# Altium project Smart_AC_Meter.PrjPcb
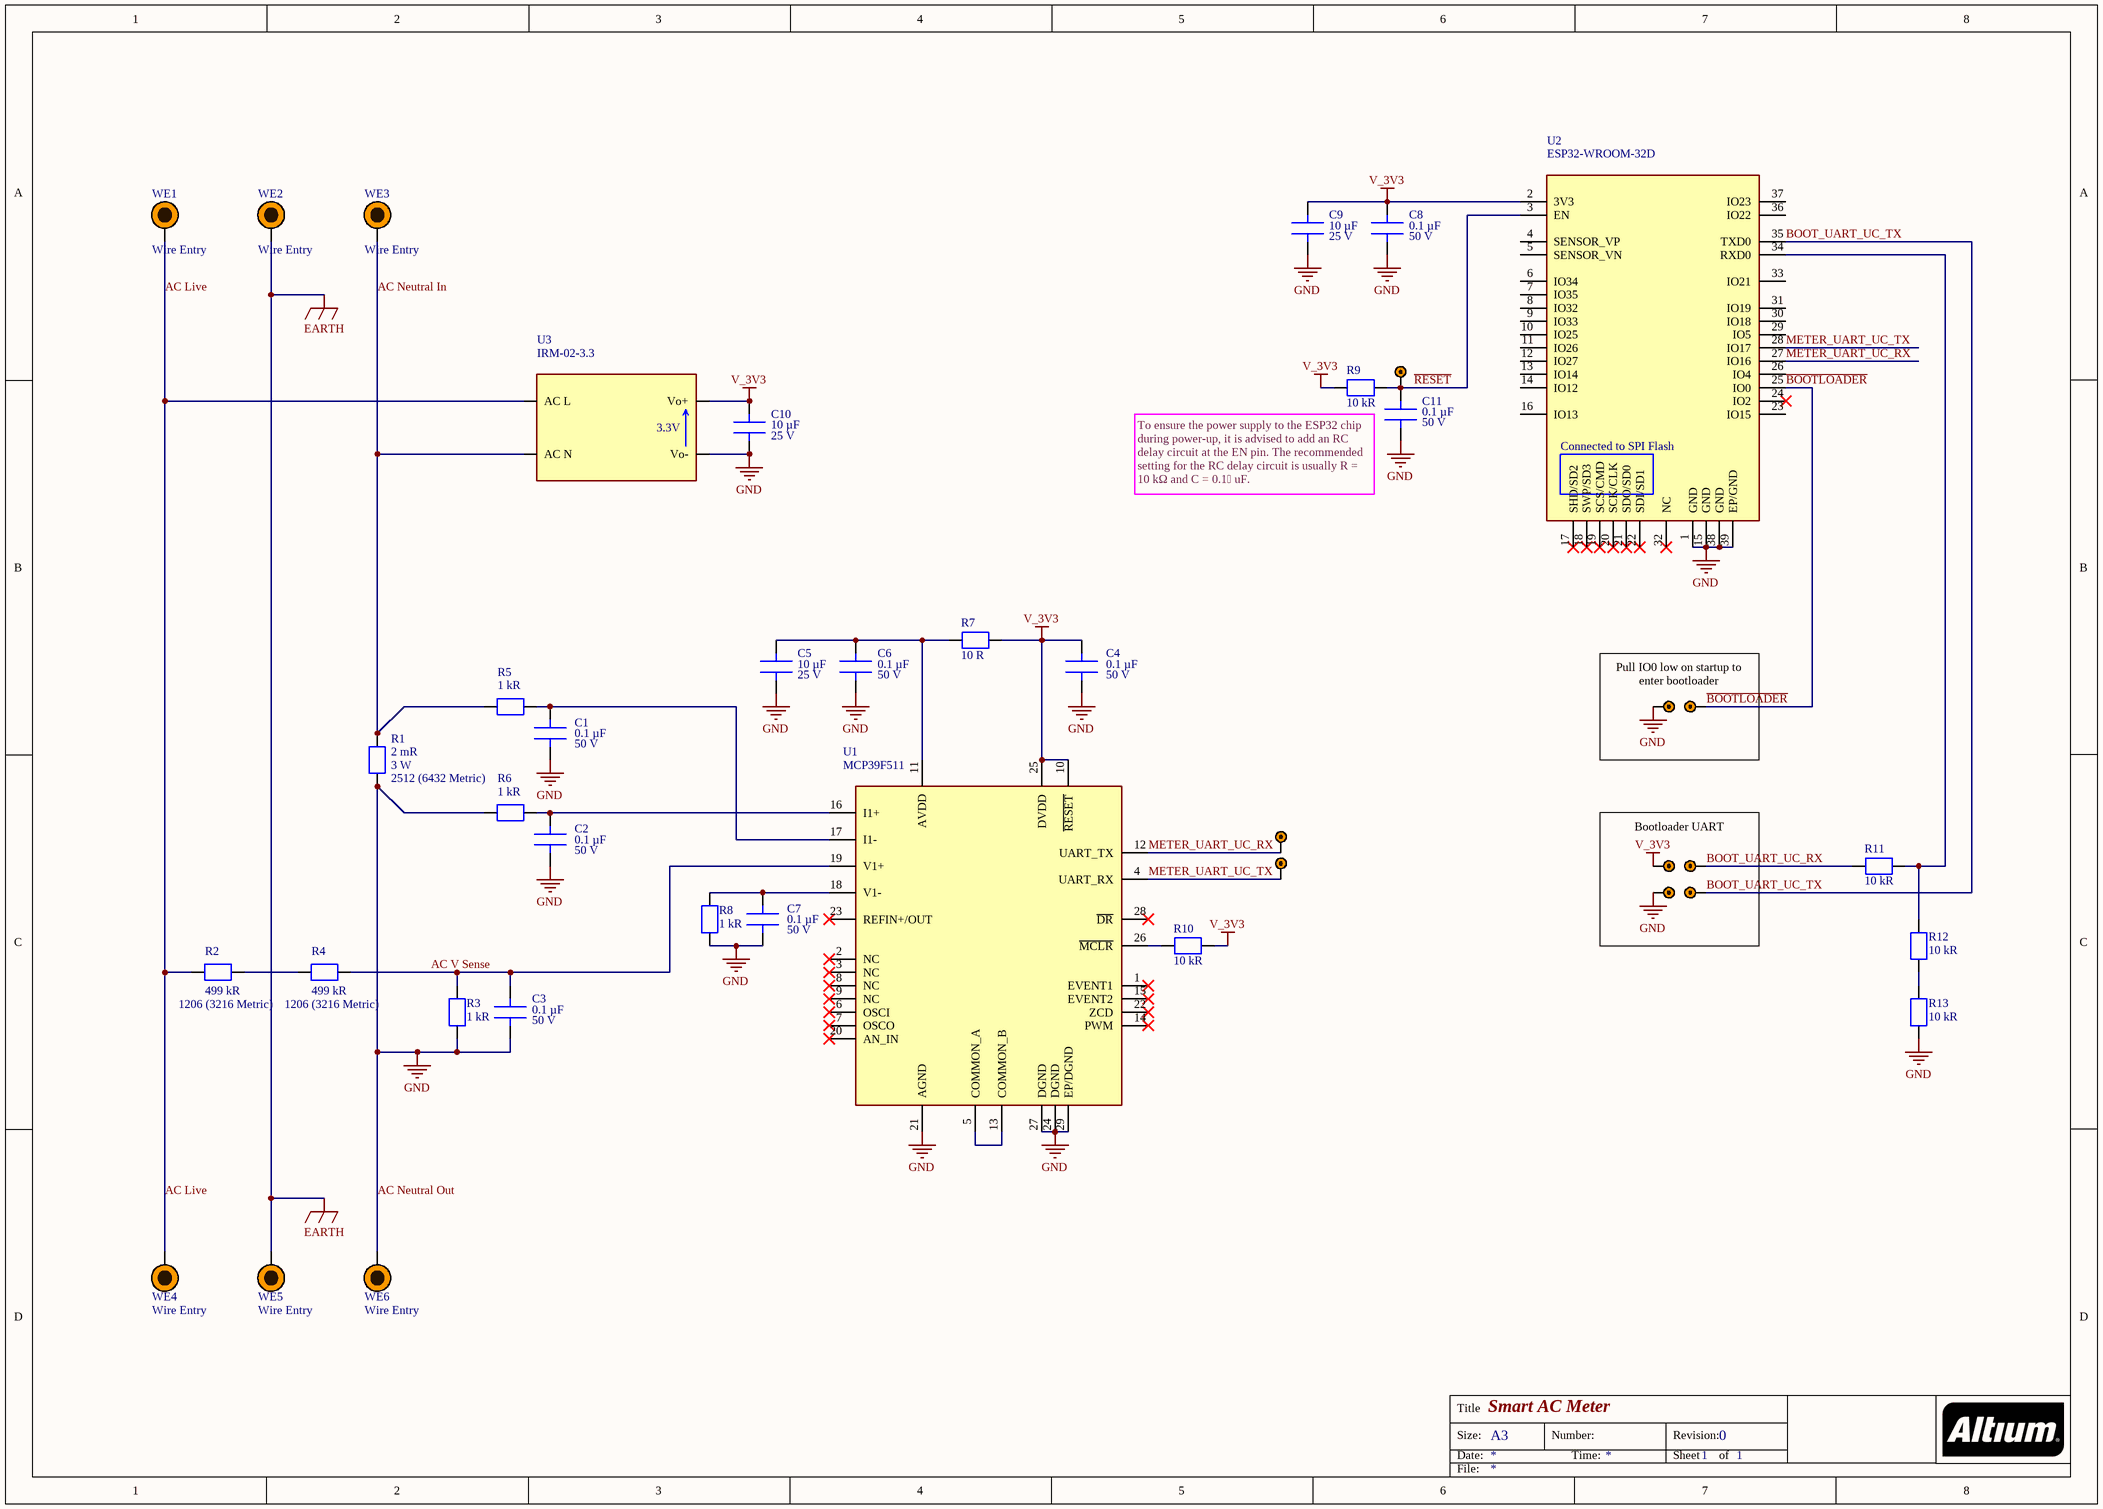
[diagram p0: Smart_AC_Meter.SchDoc]
revision: 0; title: Smart AC Monitor
1 sheet, 42 parts. Net scope: global (net labels, ports and power ports of the same name join across sheets).
Board file: Smart_AC_Meter.PcbDoc

## Sheet Smart_AC_Meter.SchDoc: Smart AC Meter
size A3; Author: Lachlan Marshall; Revision: 0; SheetNumber: 1; SheetTotal: 1

### Parts
C1  Capacitance: 0.1 µF  Voltage: 50 V  [0805]  (hidden comment: Capacitor)
C2  Capacitance: 0.1 µF  Voltage: 50 V  [0805]  (hidden comment: Capacitor)
C3  Capacitance: 0.1 µF  Voltage: 50 V  [0805]  (hidden comment: Capacitor)
C4  Capacitance: 0.1 µF  Voltage: 50 V  [0805]  (hidden comment: Capacitor)
C5  Capacitance: 10 µF  Voltage: 25 V  [0805]  (hidden comment: Capacitor)
C6  Capacitance: 0.1 µF  Voltage: 50 V  [0805]  (hidden comment: Capacitor)
C7  Capacitance: 0.1 µF  Voltage: 50 V  [0805]  (hidden comment: Capacitor)
C8  Capacitance: 0.1 µF  Voltage: 50 V  [0805]  (hidden comment: Capacitor)
C9  Capacitance: 10 µF  Voltage: 25 V  [0805]  (hidden comment: Capacitor)
C10  Capacitance: 10 µF  Voltage: 25 V  [0805]  (hidden comment: Capacitor)
C11  Capacitance: 0.1 µF  Voltage: 50 V  [0805]  (hidden comment: Capacitor)
R1  Resistance: 2 mR  Power: 3 W  Package: 2512 (6432 Metric)  [2512]  (hidden comment: Resistor)
R2  Resistance: 499 kR  Package: 1206 (3216 Metric)  [1206]  (hidden comment: Resistor)
R3  Resistance: 1 kR  [0805]  (hidden comment: Resistor)
R4  Resistance: 499 kR  Package: 1206 (3216 Metric)  [1206]  (hidden comment: Resistor)
R5  Resistance: 1 kR  [0805]  (hidden comment: Resistor)
R6  Resistance: 1 kR  [0805]  (hidden comment: Resistor)
R7  Resistance: 10 R  [0805]  (hidden comment: Resistor)
R8  Resistance: 1 kR  [0805]  (hidden comment: Resistor)
R9  Resistance: 10 kR  [0805]  (hidden comment: Resistor)
R10  Resistance: 10 kR  [0805]  (hidden comment: Resistor)
R11  Resistance: 10 kR  [0805]  (hidden comment: Resistor)
R12  Resistance: 10 kR  [0805]  (hidden comment: Resistor)
R13  Resistance: 10 kR  [0805]  (hidden comment: Resistor)
TP1  Via  [1mmVia]  (value not drawn)
TP2  Via  [1mmVia]  (value not drawn)
TP3  Via  [1mmVia]  (value not drawn)
TP4  Via  [1mmVia]  (value not drawn)
TP5  Via  [1mmVia]  (value not drawn)
TP6  Via  [1mmVia]  (value not drawn)
TP7  Via  [1mmVia]  (value not drawn)
TP8  Via  [1mmVia]  (value not drawn)
TP9  Via  [1mmVia]  (value not drawn)
U1  MCP39F511  [MCP39F511]
U2  ESP32-WROOM-32D  [ESP32-WROOM-32D]
U3  IRM-02-3.3  [IRM-02-3.3]
WE1  Wire Entry  [12AWGWireEntry]
WE2  Wire Entry  [12AWGWireEntry]
WE3  Wire Entry  [12AWGWireEntry]
WE4  Wire Entry  [12AWGWireEntry]
WE5  Wire Entry  [12AWGWireEntry]
WE6  Wire Entry  [12AWGWireEntry]

### Nets
AC Neutral Out: C1.2 C2.2 C3.2 C4.2 C5.2 C6.2 C7.2 C8.2 C9.1 C10.1 C11.2 R1.2 R3.2 R6.1 R8.1 R13.1 TP1.1 TP5.1 U1.21(AGND) U1.24(DGND) U1.27(DGND) U1.29(EP/DGND) U2.1(GND) U2.15(GND) U2.38(GND) U2.39(EP/GND) U3.13(Vo-) WE6.1  [also labelled GND]
EARTH: WE2.1 WE5.1
V_3V3: C4.1 C8.1 C9.2 C10.2 R7.2 R9.1 R10.2 TP3.1 U1.10(~{RESET}) U1.25(DVDD) U2.2(3V3) U3.12(Vo+)
AC Live: R2.1 U3.1(AC_L) WE1.1 WE4.1
AC Neutral In: R1.1 R5.1 U3.24(AC_N) WE3.1
AC V Sense: C3.1 R3.1 R4.2 U1.19(V1+)
~{BOOTLOADER}: TP2.1 U2.25(IO0)
BOOT_UART_UC_RX: R11.1 TP4.1
BOOT_UART_UC_TX: TP6.1 U2.35(TXD0)
METER_UART_UC_RX: TP7.1 U1.12(UART_TX) U2.27(IO16)
METER_UART_UC_TX: TP8.1 U1.4(UART_RX) U2.28(IO17)
~{RESET}: C11.1 R9.2 TP9.1 U2.3(EN)
NetC1_1: C1.1 R5.2 U1.17(I1-)
NetC2_1: C2.1 R6.2 U1.16(I1+)
NetC5_1: C5.1 C6.1 R7.1 U1.11(AVDD)
NetC7_1: C7.1 R8.2 U1.18(V1-)
NetR2_2: R2.2 R4.1
NetR10_1: R10.1 U1.26(~{MCLR})
NetR11_2: R11.2 R12.2 U2.34(RXD0)
NetR12_1: R12.1 R13.2
NetU1_5: U1.5(COMMON_A) U1.13(COMMON_B)

Not connected (* = marked no-connect by the designer): U1 1(EVENT1)* 2(NC)* 3(NC)* 6(OSCI)* 7(OSCO)* 8(NC)* 9(NC)* 14(PWM)* 15(EVENT2)* 20(AN_IN)* 22(ZCD)* 23(REFIN+/OUT)* 28(~{DR})*; U2 4(SENSOR_VP) 5(SENSOR_VN) 6(IO34) 7(IO35) 8(IO32) 9(IO33) 10(IO25) 11(IO26) 12(IO27) 13(IO14) 14(IO12) 16(IO13) 17(SHD/SD2)* 18(SWP/SD3)* 19(SCS/CMD)* 20(SCK/CLK)* 21(SDO/SD0)* 22(SDI/SD1)* 23(IO15) 24(IO2)* 26(IO4) 29(IO5) 30(IO18) 31(IO19) 32(NC)* 33(IO21) 36(IO22) 37(IO23)

### Notes on the sheet
- To ensure the power supply to the ESP32 chip during power-up, it is advised to add an RC delay circuit at the EN pin. The recommended setting for the RC delay circuit is usually R = 10 kΩ and C = 0.1 uF.
- Pull IO0 low on startup to enter bootloader
- Bootloader UART
- Title
- Size:
- Date:
- A3
- Number:
- Time:
- Revision:
- Sheet
- of
- File:
- (in symbol ESP32-WROOM-32D) Connected to SPI Flash
- (in symbol IRM-02-3.3) 3.3V

### Library data of the parts
C1-C4 C6-C8 C11 = Capacitor: AVX Corporation 08055D104KAT2A; Unique Part Number: LM_CAP_0001; Type (Ceramic, Aluminium, etc#): Ceramic X5R; Tolerance: ±10%; Manufacturer Part Number: AVX Corporation 08055D104KAT2A; Digikey Part Number: 478-12790-1-ND; Package: 0805 (2012 Metric)
C5 C9 C10 = Taiyo Yuden TMK212BBJ106KG-T: Unique Part Number: LM_CAP_0002; Type (Ceramic, Aluminium, etc#): Ceramic X5R; Tolerance: ±10%; Manufacturer Part Number: Taiyo Yuden TMK212BBJ106KG-T; Digikey Part Number: 587-2985-1-ND; Package: 0805 (2012 Metric)
R1 = 2 mR 2512 (6432 Metric) Chip: Unique Part Number: LM_RES_0002; Manufacturer Part Number: Riedon CSRL3-0R002F8; Type (Chip, Axial, etc#): Chip; Tolerance: 0.01; Digikey Part Number: 696-1836-1-ND
R2 R4 = 499 kR 1206 (3216 Metric) Chip: Unique Part Number: LM_RES_0003; Manufacturer Part Number: Stackpole Electronics Inc RMCF1206FT499K; Type (Chip, Axial, etc#): Chip; Power: 0.25 W; Tolerance: 0.01; Digikey Part Number: RMCF1206FT499KCT-ND
R3 R5 R6 R8 = 1 kR 0805 (2012 Metric) Chip: Unique Part Number: LM_RES_0001; Manufacturer Part Number: Stackpole Electronics Inc RMCF0805FT1K00; Type (Chip, Axial, etc#): Chip; Power: 0.125 W; Tolerance: 0.01; Digikey Part Number: RMCF0805FT1K00CT-ND; Package: 0805 (2012 Metric)
R7 = 10 R 0805 (2012 Metric) Chip: Unique Part Number: LM_RES_0004; Manufacturer Part Number: Stackpole Electronics Inc RMCF0805FT10R0; Type (Chip, Axial, etc#): Chip; Power: 0.125 W; Tolerance: 0.01; Digikey Part Number: RMCF0805FT10R0CT-ND; Package: 0805 (2012 Metric)
R9-R13 = 10 kR 0805 (2012 Metric) Chip: Unique Part Number: LM_RES_0005; Manufacturer Part Number: Stackpole Electronics Inc RMCF0805FT10K0; Type (Chip, Axial, etc#): Chip; Power: 0.125 W; Tolerance: 0.01; Digikey Part Number: RMCF0805FT10K0CT-ND; Package: 0805 (2012 Metric)
TP1-TP9 = Via: 1mm dia via/through hole; Unique Part Number: LM_OTH_0002
U1 = MCP39F511: Single Phase Meter IC 28-QFN (5x5); Unique Part Number: LM_IC_0001; Manufacturer Part Number: Microchip Technology MCP39F511-E/MQ; Digikey Part Number: MCP39F511-E/MQ-ND; Package: 28-QFN (5x5); Temperature Range: -40°C ~ 125°C
U2 = ESP32-WROOM-32D: Bluetooth, WiFi,3 Transceiver Module; Unique Part Number: LM_IC_0002; Manufacturer Part Number: Espressif Systems ESP32-WROOM-32D; Digikey Part Number: 1904-1023-1-ND; Package: 38-SMD Module; Temperature Range: -40°C ~ 85°C
U3 = IRM-02-3.3: Enclosed AC DC Converter 1 Output 3.3V 600mA; Unique Part Number: LM_IC_0003; Manufacturer Part Number: MEAN WELL USA Inc. IRM-02-3.3; Digikey Part Number: 1866-3007-ND; Package: 4-DIP Module; Temperature Range: -30°C ~ 85°C (With Derating)
WE1-WE6 = Wire Entry: 12 AWG Wire Entry; Unique Part Number: LM_OTH_0001